# Altium schematic sheet MUC.SchDoc
size A4
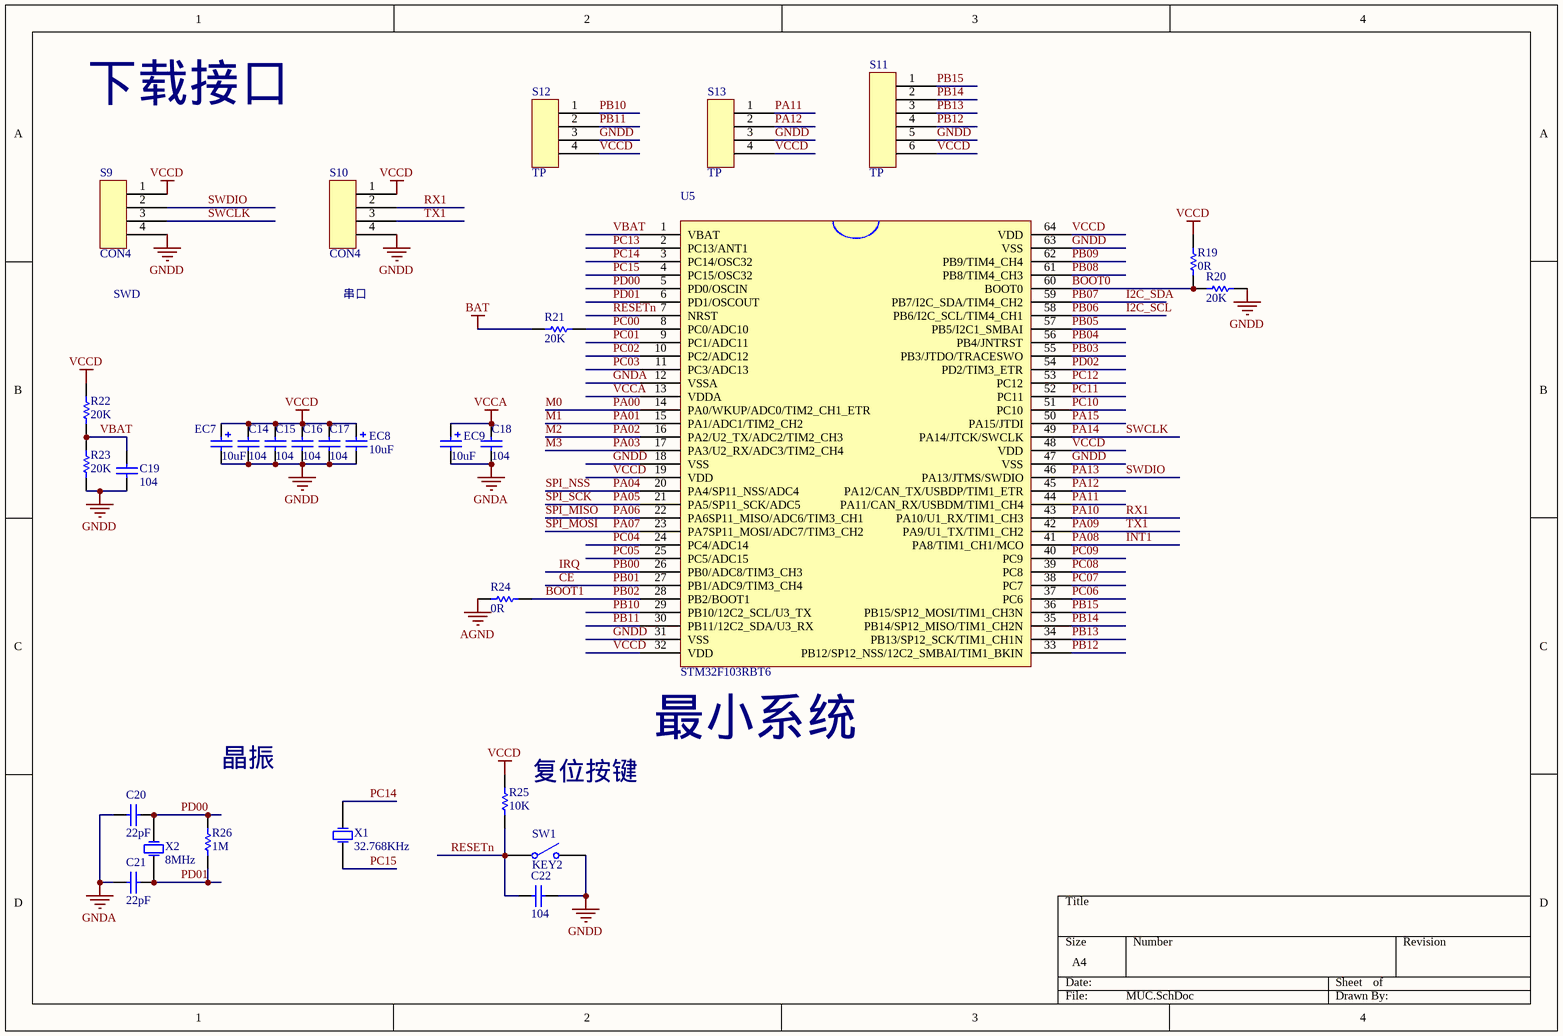
[diagram p0: MUC.SchDoc]

## Parts
C14  104  [0603]
C15  104  [0603]
C16  104  [0603]
C17  104  [0603]
C18  104  [0603]
C19  104  [0603]
C20  22pF  [0805]
C21  22pF  [0805]
C22  104  [0603]
EC7  10uF  [1206]
EC8  10uF  [1206]
EC9  10uF  [1206]
R19  0R  [0603]
R20  20K  [0603]
R21  20K  [0603]
R22  20K  [0603]
R23  20K  [0603]
R24  0R  [0603]
R25  10K  [0603]
R26  1M  [0805]
S9  CON4  [SIP4]
S10  CON4  [SIP4]
S11  TP  [TP6]
S12  TP  [TP4]
S13  TP  [TP4]
SW1  KEY2  [SSOP2N]
U5  STM32F103RBT6  [TSQFP50P1200X1200X160-64N]
X1  32.768KHz  [XTAL-50-2]
X2  8MHz  [XTAL-200]

## Nets
AGND: R24.1
BAT: R21.1
GNDA: C18.1 C20.1 C21.1 EC9.2 U5.12(VSSA)
GNDD: C14.1 C15.1 C16.1 C17.1 C19.1 C22.2 EC7.2 EC8.2 R20.2 R23.1 S9.4 S10.4 S11.5 S12.3 S13.3 SW1.2(NO1) U5.18(VSS) U5.31(VSS) U5.47(VSS) U5.63(VSS)
VCCA: C18.2 EC9.1 U5.13(VDDA)
VCCD: C14.2 C15.2 C16.2 C17.2 EC7.1 EC8.1 R19.2 R22.2 R25.2 S9.1 S10.1 S11.6 S12.4 S13.4 U5.19(VDD) U5.32(VDD) U5.48(VDD) U5.64(VDD)
BOOT0: R19.1 R20.1 U5.60(BOOT0)
BOOT1: R24.2 U5.28(PB2/BOOT1)  [also labelled PB02]
CE: U5.27(PB1/ADC9/TIM3_CH4)  [also labelled PB01]
I2C_SCL: U5.58(PB6/I2C_SCL/TIM4_CH1)  [also labelled PB06]
I2C_SDA: U5.59(PB7/I2C_SDA/TIM4_CH2)  [also labelled PB07]
INT1: U5.41(PA8/TIM1_CH1/MCO)  [also labelled PA08]
IRQ: U5.26(PB0/ADC8/TIM3_CH3)  [also labelled PB00]
M0: U5.14(PA0/WKUP/ADC0/TIM2_CH1_ETR)  [also labelled PA00]
M1: U5.15(PA1/ADC1/TIM2_CH2)  [also labelled PA01]
M2: U5.16(PA2/U2_TX/ADC2/TIM2_CH3)  [also labelled PA02]
M3: U5.17(PA3/U2_RX/ADC3/TIM2_CH4)  [also labelled PA03]
PA04: U5.20(PA4/SP11_NSS/ADC4)  [also labelled SPI_NSS]
PA05: U5.21(PA5/SP11_SCK/ADC5)  [also labelled SPI_SCK]
PA06: U5.22(PA6SP11_MISO/ADC6/TIM3_CH1)  [also labelled SPI_MISO]
PA07: U5.23(PA7SP11_MOSI/ADC7/TIM3_CH2)  [also labelled SPI_MOSI]
PA09: S10.3 U5.42(PA9/U1_TX/TIM1_CH2)  [also labelled TX1]
PA10: S10.2 U5.43(PA10/U1_RX/TIM1_CH3)  [also labelled RX1]
PA11: S13.1 U5.44(PA11/CAN_RX/USBDM/TIM1_CH4)
PA12: S13.2 U5.45(PA12/CAN_TX/USBDP/TIM1_ETR)
PA13: S9.2 U5.46(PA13/JTMS/SWDIO)  [also labelled SWDIO]
PA14: S9.3 U5.49(PA14/JTCK/SWCLK)  [also labelled SWCLK]
PA15: U5.50(PA15/JTDI)
PB03: U5.55(PB3/JTDO/TRACESWO)
PB04: U5.56(PB4/JNTRST)
PB05: U5.57(PB5/I2C1_SMBAI)
PB08: U5.61(PB8/TIM4_CH3)
PB09: U5.62(PB9/TIM4_CH4)
PB10: S12.1 U5.29(PB10/12C2_SCL/U3_TX)
PB11: S12.2 U5.30(PB11/12C2_SDA/U3_RX)
PB12: S11.4 U5.33(PB12/SP12_NSS/12C2_SMBAI/TIM1_BKIN)
PB13: S11.3 U5.34(PB13/SP12_SCK/TIM1_CH1N)
PB14: S11.2 U5.35(PB14/SP12_MISO/TIM1_CH2N)
PB15: S11.1 U5.36(PB15/SP12_MOSI/TIM1_CH3N)
PC00: R21.2 U5.8(PC0/ADC10)
PC01: U5.9(PC1/ADC11)
PC02: U5.10(PC2/ADC12)
PC03: U5.11(PC3/ADC13)
PC04: U5.24(PC4/ADC14)
PC05: U5.25(PC5/ADC15)
PC06: U5.37(PC6)
PC07: U5.38(PC7)
PC08: U5.39(PC8)
PC09: U5.40(PC9)
PC10: U5.51(PC10)
PC11: U5.52(PC11)
PC12: U5.53(PC12)
PC13: U5.2(PC13/ANT1)
PC14: U5.3(PC14/OSC32) X1.2(OSC2)
PC15: U5.4(PC15/OSC32) X1.1(OSC1)
PD00: C20.2 R26.2 U5.5(PD0/OSCIN) X2.2(OSC2)
PD01: C21.2 R26.1 U5.6(PD1/OSCOUT) X2.1(OSC1)
PD02: U5.54(PD2/TIM3_ETR)
RESETn: C22.1 R25.1 SW1.1(COMMON1) U5.7(NRST)
VBAT: C19.2 R22.1 R23.2 U5.1(VBAT)

## Notes on the sheet
- 下载接口
- SWD
- 串口
- 晶振
- (near R25) 复位按键
- (near U5) 最小系统

## Library data of the parts
C14-C22 = CAP
EC7-EC9 = EC
R19-R26 = RES
S11 = CON6
S12 S13 = CON4
X1 X2 = XTAL